# EAGLE design Tonemender (EAGLE 8.5.0)
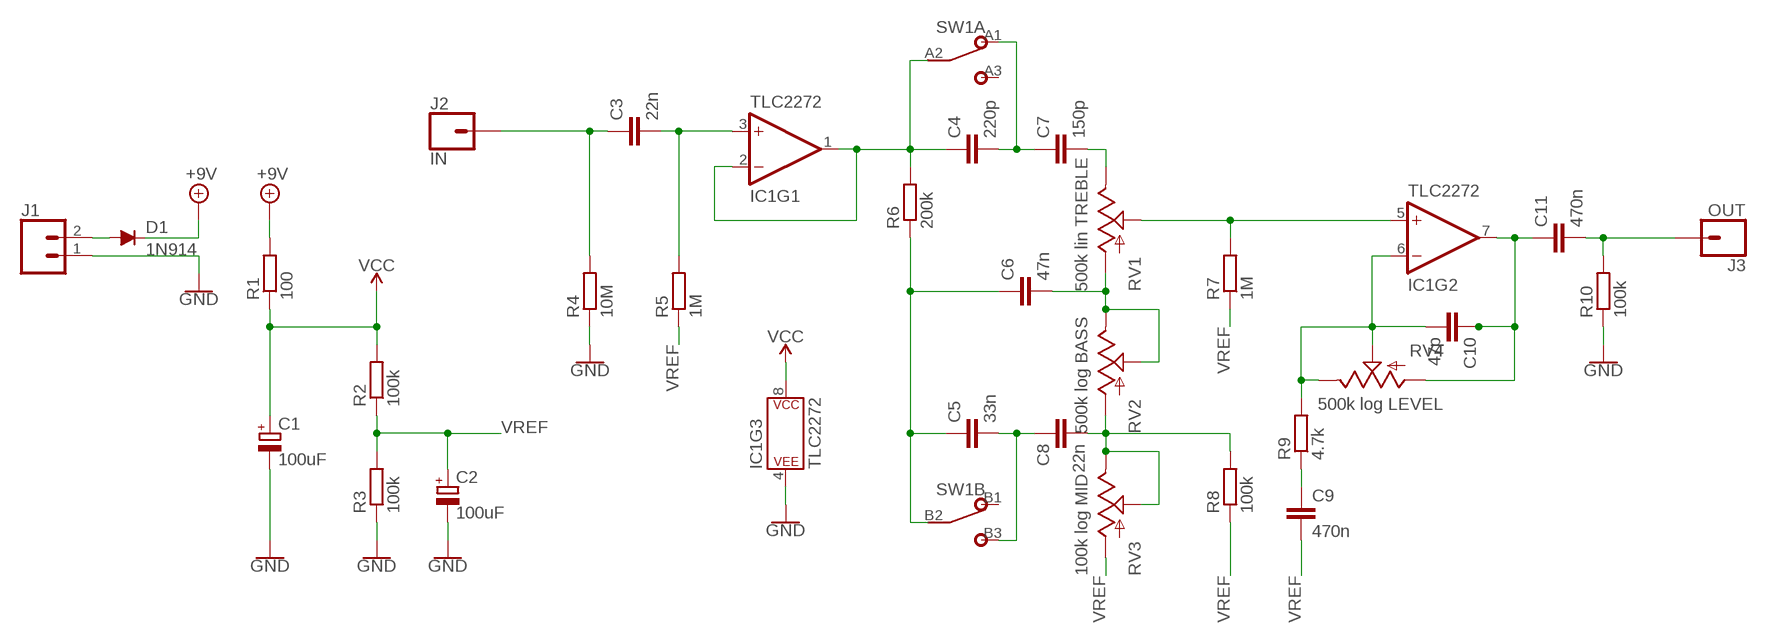
[diagram p0: schematic, sheet 1]

## Parts
C1  100uF  CPOL-EUE2.5-5  [E2,5-5]
C2  100uF  CPOL-EUE2.5-5  [E2,5-5]
C3  22n  C-EUC0805  [C0805]
C4  220p  C-EUC0805  [C0805]
C5  33n  C-EUC0805  [C0805]
C6  47n  C-EUC0805  [C0805]
C7  150p  C-EUC0805  [C0805]
C8  22n  C-EUC0805  [C0805]
C9  470n  C-EUC0805  [C0805]
C10  47p  C-EUC0805  [C0805]
C11  470n  C-EUC0805  [C0805]
D1  1N914  1N4148-6  [DO35-6]
IC1  TLC2272  OPAMP-DUALU  [SO08]
J1  CONN_02  [1X02]
J2  IN  CONN_01  [1X01]
J3  OUT  CONN_01  [1X01]
R1  100  R-EU_M0805  [M0805]
R2  100k  R-EU_M0805  [M0805]
R3  100k  R-EU_M0805  [M0805]
R4  10M  R-EU_M0805  [M0805]
R5  1M  R-EU_M0805  [M0805]
R6  200k  R-EU_M0805  [M0805]
R7  1M  R-EU_M0805  [M0805]
R8  100k  R-EU_M0805  [M0805]
R9  4.7k  R-EU_M0805  [M0805]
R10  100k  R-EU_M0805  [M0805]
RV1  500k lin TREBLE  POTPADS  [1X03]
RV2  500k log BASS  POTPADS  [1X03]
RV3  100k log MID  POTPADS  [1X03]
RV4  500k log LEVEL  POTPADS  [1X03]
SW1  DPDTPADS  [DPDT_PADS]

## Nets
+9V: D1.C R1.2
GND: C1.- C2.- IC1.4(P$V-) J1.1 R3.1 R4.1 R10.1
N$1: C4.1 IC1.1(OUT) IC1.2(-IN) R6.2 SW1.A2
N$2: C3.2 IC1.3(+IN) R5.2
N$3: C4.2 C7.1 SW1.A1
N$4: C7.2 RV1.3(E)
N$5: C5.1 C6.1 R6.1 SW1.B2
N$6: C6.2 RV1.1(A) RV2.2(S) RV2.3(E)
N$7: C5.2 C8.1 SW1.B3
N$8: C8.2 R8.2 RV2.1(A) RV3.2(S) RV3.3(E)
N$9: IC1.5(+IN) R7.2 RV1.2(S)
N$10: C10.1 C11.1 IC1.7(OUT) RV4.1(A)
N$11: C10.2 IC1.6(-IN) R9.2 RV4.2(S) RV4.3(E)
N$12: D1.A J1.2
N$15: C9.1 R9.1
N$18: C3.1 J2.1 R4.2
N$20: C11.2 J3.1 R10.2
VCC: C1.+ IC1.8(P$V+) R1.1 R2.2
VREF: C2.+ C9.2 R2.1 R3.2 R5.1 R7.1 R8.1 RV3.1(A)
Unconnected: SW1.A3 SW1.B1

## Library data of the parts
C1 C2 = rcl:CPOL-EU: POLARIZED CAPACITOR, European symbol
C3-C11 = resistor:C-EU: CAPACITOR, European symbol
D1 = diode:1N4148: DIODE high speed (Philips)
IC1 = SparkFun-IC-Amplifiers:OPAMP-DUAL: Generic op-amp footprint This component is for the standard 358 pinning of a dual op-amp From the LM358 datasheet: Pin 1: Output A Pin 2: Inverting Input A Pin 3: Non-Inverting Input A Pin 4: Gnd Pin 5: Non-Inverting Input B Pin 6: Inverting Input B Pin 7: Output B Pin 8: V+; PROD_ID: NA-XXXXX; VALUE: OP-AMP
J1 = SparkFun-Connectors:CONN_02: Multi connection point. Often used as Generic Header-pin footprint for 0.1 inch spaced/style header connections On any of the 0.1 inch spaced packages, you can populate with these: Break Away Headers - Straight <https://www.sparkfun.com/products/116> (PRT-00116) Break Away Male Headers - Right Angle <https://www.sparkfun.com/products/553> (PRT-00553) Female Headers <https://www.sparkfun.com/products/115> (PRT-00115) Break Away Headers - Machine Pin <https://www.sparkfun.com/products/117> (PRT-00117) Break Away Female Headers - Swiss Machine Pin <https://www.sparkfun.com/products/743> (PRT-00743) For SCREWTERMINALS and SPRING TERMINALS visit here: Screw Terimnals on SparkFun.com <https://www.sparkfun.com/search/results?term=Screw+Terminals> (5mm/3.5mm/2.54mm spacing) This device is also useful as a general connection point to wire up your design to another part of your project. Our various solder wires solder well into these plated through hole pads. Hook-Up Wire - Assortment (Stranded, 22 AWG) <https://www.sparkfun.com/products/11375> (PRT-11375) Hook-Up Wire - Assortment (Solid Core, 22 AWG) <https://www.sparkfun.com/products/11367> (PRT-11367) View the entire wire category on our website here <https://www.sparkfun.com/categories/141> Special notes: Molex polarized connector foot print use with: PRT-08233 with associated crimp pins and housings. 2.54_SCREWTERM for use with PRT-10571. 3.5mm Screw Terminal footprints for PRT-08084 5mm Screw Terminal footprints for use with PRT-08432
J2 J3 = SparkFun-Connectors:CONN_01: Single connection point. Often used as Generic Header-pin footprint for 0.1 inch spaced/style header connections On any of the 0.1 inch spaced packages, you can populate with these: Break Away Headers - Straight <https://www.sparkfun.com/products/116> (PRT-00116) Break Away Male Headers - Right Angle <https://www.sparkfun.com/products/553> (PRT-00553) Female Headers <https://www.sparkfun.com/products/115> (PRT-00115) Break Away Headers - Machine Pin <https://www.sparkfun.com/products/117> (PRT-00117) Break Away Female Headers - Swiss Machine Pin <https://www.sparkfun.com/products/743> (PRT-00743) This device is also useful as a general connection point to wire up your design to another part of your project. Our various solder wires solder well into these plated through hole pads. Hook-Up Wire - Assortment (Stranded, 22 AWG) <https://www.sparkfun.com/products/11375> (PRT-11375) Hook-Up Wire - Assortment (Solid Core, 22 AWG) <https://www.sparkfun.com/products/11367> (PRT-11367) View the entire wire category on our website here <https://www.sparkfun.com/categories/141> Special notes: SMTSO-256-ET is a "flush mount" nut for a 4-40 screw. We mostly use this on specialty testbeds; it is a nice way to connect hardware to your PCB at an adjustable hieght. Also note, the SNAP packages are for using a snappable style connector. We sell a baggie of snaps and they are also used on two LilyPad designs: Snap Assortment - 30 pack (male and female) <https://www.sparkfun.com/products/11347> (DEV-11347) LilyPad Arduino SimpleSnap <https://www.sparkfun.com/products/10941> (DEV-10941) LilyPad SimpleSnap Protoboard <https://www.sparkfun.com/products/10940> (DEV-10940)
R1-R10 = resistor:R-EU_: RESISTOR, European symbol
RV1-RV4 = SparkFun-Retired:POT
SW1 = gm-switches:DPDT

## Board
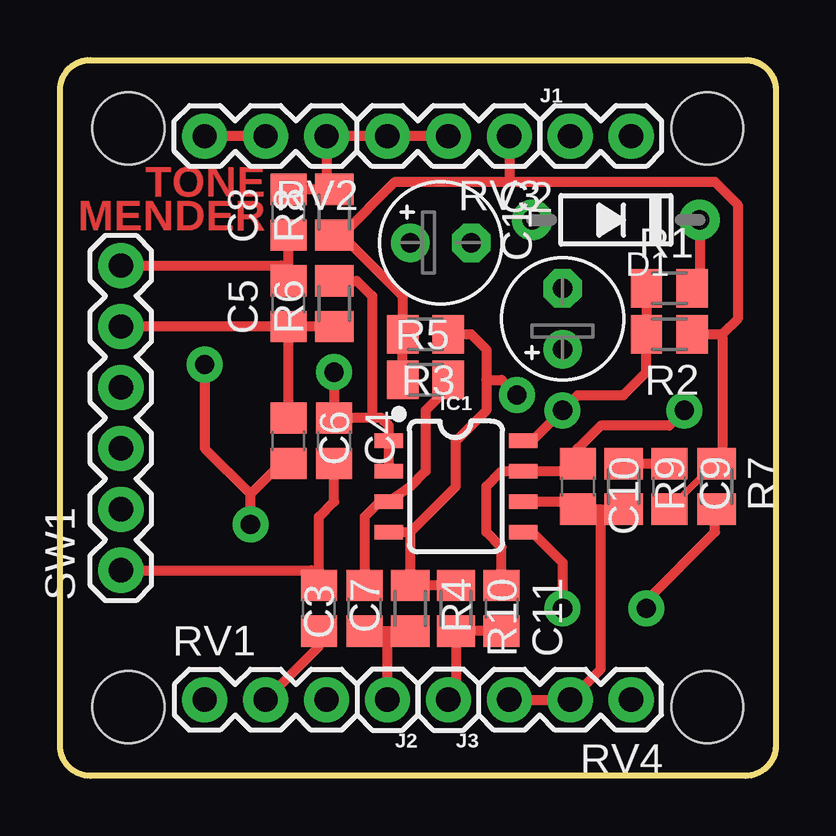
[diagram p1: board, top side]
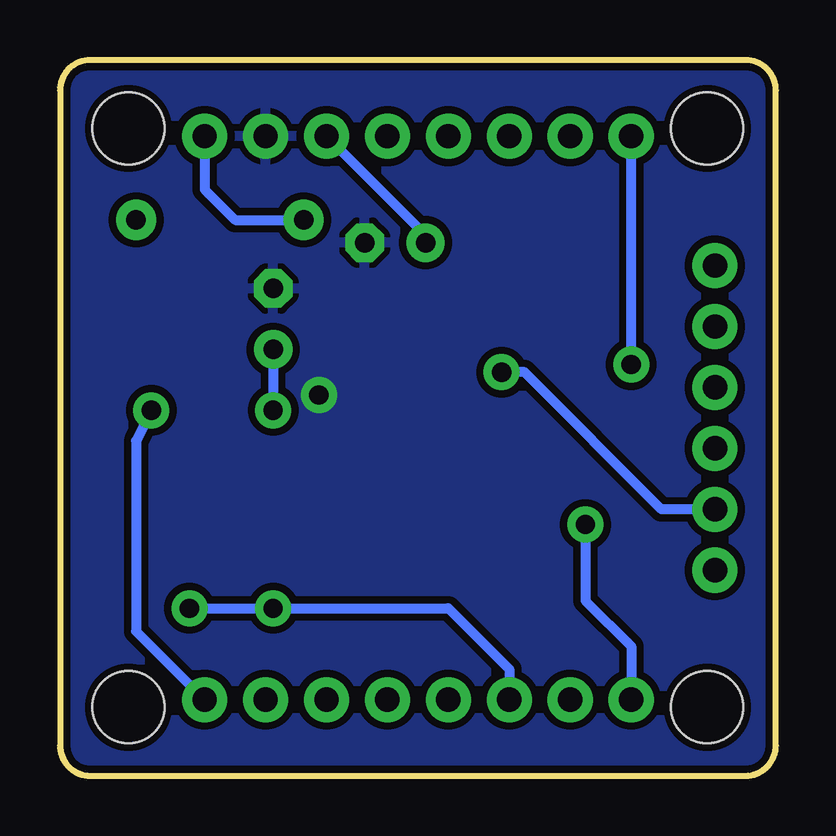
[diagram p2: board, bottom side, seen from below]

Size 29.84 x 29.84 mm. Coordinates in mm from the lower left corner, seen from the top.
Outline: 1.27,29.84 28.57,29.84 arc-90 29.84,28.57 29.84,1.27 arc-90 28.57,0 1.27,0 arc-90 0,1.27 0,28.57 arc-90 1.27,29.84
Copper layers (1*16): Top 0.035mm / dielectric 1.5mm / Bottom 0.035mm
Design rules "default *": minimum track width 10mil, minimum drill 24mil, track to track 8mil, track to pad 8mil, pad to pad 8mil, via to via 8mil, smd to smd 8mil, copper to edge 10mil, drill to drill 8mil, minimum pad ring 10mil, minimum via ring 8mil, stop-mask expansion 4mil, vias tented up to drill 0mil, thermal gap 10mil
Holes 3 mm at 26.99,26.99 26.99,2.86 2.86,2.86 2.86,26.99

### Footprints (pad centres in the part's own frame; a part is rotated, then mirrored left to right if it is on the bottom)
E2,5-5 = drill 0.813 pad 1.6: + -1.27,0 | drill 0.813 pad 1.6 octagon: - 1.27,0
C0805 = smd 1.3 x 1.5: 1 -0.95,0; 2 0.95,0
DO35-6 = drill 0.813 pad 1.676: A 3.493,0; C -3.493,0
SO08 = smd 0.6 x 1.2: 1 -1.905,-2.8; 2 -0.635,-2.8; 3 0.635,-2.8; 4 1.905,-2.8; 5 1.905,2.8; 6 0.635,2.8; 7 -0.635,2.8; 8 -1.905,2.8
1X02 = drill 1.016 pad 1.88: 1 0,0; 2 2.54,0
1X01 = drill 1.016 pad 1.88: 1 0,0
M0805 = smd 1.3 x 1.6: 1 -0.95,0; 2 0.95,0
1X03 = drill 1.016 pad 1.88: 1 0,0; 2 5.08,0; 3 2.54,0
DPDT_PADS = drill 1.016 pad 1.88: A1 0,0; A2 2.54,0; A3 5.08,0; B1 7.62,0; B2 10.16,0; B3 12.7,0

### Placement (x,y rotation side)
C1  20.95,19.05 90 top
C2  15.88,22.23 0 top
C3  12.7,6.99 90 top
C4  11.43,13.97 270 top
C5  9.53,19.68 90 top
C6  9.53,13.97 270 top
C7  10.79,6.99 270 top
C8  9.53,23.5 90 top
C9  25.4,12.06 270 top
C10  21.59,12.06 270 top
C11  18.41,6.99 270 top
D1  23.18,23.18 180 top
IC1  16.51,12.06 270 top
J1  21.27,26.67 0 top
J2  13.65,3.17 180 top
J3  16.19,3.17 180 top
R1  25.4,20.32 0 top
R2  25.4,18.41 180 top
R3  15.24,18.41 180 top
R4  14.61,6.99 270 top
R5  15.24,16.51 0 top
R6  11.43,19.68 90 top
R7  27.37,12.06 270 top
R8  11.43,23.5 90 top
R9  23.5,12.06 270 top
R10  16.51,6.99 270 top
RV1  6.03,3.17 0 top
RV2  11.11,26.67 180 top
RV3  18.73,26.67 180 top
RV4  23.81,3.17 180 top
SW1  2.54,8.57 90 top

### Tracks (layer width: path | path; a pad name or v marks a point on that pad's centre or on a via)
+9V
  Top 0.406: D1.C 26.67,20.64 R1.2
GND  (via drill 0.8 pad 1.5)
  Top 0.406: 14.61,10.16 16.51,12.06 16.51,13.97 17.78,15.24 17.78,16.51 | R10.1 R4.1 14.61,10.16 | R3.1 17.14,18.41 17.78,17.78 17.78,16.51 | 17.78,16.51 18.41,16.51 v19.05,15.88 | IC1.4 14.61,10.16
  pour Bottom (isolate 0.305): 29.84,28.57 29.84,1.27 arc-90 28.57,0 1.27,0 arc-90 0,1.27 0,28.57 arc-90 1.27,29.84 28.57,29.84 arc-90
N$1  (via drill 0.8 pad 1.5)
  Top 0.406: IC1.2 IC1.1 13.71,14.61 13.39,14.92 13.02,14.92 | v11.43,16.83 C4.1 13.02,14.92 | R6.2 12.38,20.64 13.02,20 13.02,14.92
  Bottom 0.406: v11.43,16.83 10.48,16.83 4.76,11.11 SW1.A2
N$2
  Top 0.406: R5.2 16.19,16.19 15.24,15.24 15.24,12.7 14.61,12.06 IC1.3 13.34,11.43 12.7,10.79 C3.2
N$3
  Top 0.406: 10.79,8.26 10.79,10.79 11.43,11.43 C4.2 | 10.79,8.26 C7.1 | SW1.A1 10.48,8.57 10.79,8.26
N$4
  Top 0.406: C7.2 10.79,5.4 RV1.3
N$5
  Top 0.406: R6.1 C5.1 | C6.1 C5.1 | C5.1 SW1.B2
N$6  (via drill 0.8 pad 1.5)
  Top 0.406: RV2.3 RV2.2 | C6.2 9.21,13.02 7.94,11.75 | v7.94,10.48 7.94,11.75 | v6.03,17.14 6.03,13.65 7.94,11.75
  Bottom 0.406: v6.03,17.14 RV2.2 | RV1.1 6.03,5.4 7.94,7.3 v7.94,10.48
N$7
  Top 0.406: 9.53,20.95 C5.2 | 9.53,20.95 C8.1 | SW1.B3 9.21,21.27 9.53,20.95
N$8
  Top 0.406: RV3.3 RV3.2 RV2.1 11.11,24.76 10.79,24.45 | 10.79,24.45 C8.2 | 10.79,24.45 R8.2
N$9  (via drill 0.8 pad 1.5)
  Top 0.406: IC1.5 19.68,10.16 20.95,8.89 v20.95,6.99 | v24.45,6.99 24.45,7.3 27.3,10.16 27.3,11.05 R7.2
  Bottom 0.406: v24.45,6.99 v20.95,6.99 13.65,6.99 11.11,4.45 RV1.2
N$10  (via drill 0.8 pad 1.5)
  Top 0.406: C11.1 18.41,9.53 17.78,10.16 17.78,12.06 18.41,12.7 IC1.7 21.27,12.7 C10.1 21.59,13.65 22.54,14.61 25.4,14.61 v26.04,15.24
  Bottom 0.406: v26.04,15.24 26.67,13.97 26.67,6.03 RV4.1
N$11
  Top 0.406: IC1.6 20.95,11.43 C10.2 22.54,11.12 | RV4.2 RV4.3 22.54,4.45 22.54,11.12 | 22.54,11.12 R9.2
N$12
  Bottom 0.406: D1.A 22.54,23.18 23.81,24.45 J1.2
N$15
  Top 0.406: R9.1 C9.1
N$18
  Top 0.406: R4.2 C3.1 13.65,5.72 J2.1
N$20
  Top 0.406: C11.2 R10.2 16.51,3.49 J3.1
VCC  (via drill 0.8 pad 1.5)
  Top 0.406: R1.1 R2.2 24.45,16.83 23.5,15.88 21.59,15.88 v20.95,15.24 19.68,13.97 IC1.8
  Bottom 0.406: C1.+ v20.95,15.24
VREF
  Top 0.292: 27.3,13.02 25.72,11.43
  Top 0.406: R5.1 R3.2 14.29,20 11.74,22.55 | 27.62,18.41 27.62,13.34 R7.1 27.3,13.02 | RV3.1 18.73,24.77 | 25.72,11.43 25.71,11.43 C9.2 | R2.1 27.62,18.41 | 18.73,24.77 13.97,24.77 11.75,22.55 11.74,22.55 | 27.62,18.41 28.26,19.05 28.26,23.81 27.3,24.77 18.73,24.77 | R8.1 11.74,22.55
  Bottom 0.406: C2.+ 14.61,22.54 RV3.1

### Text on the board
Top: TONE | MENDER